# Altium schematic sheet EV_SH.SchDoc
size A4; PageSetup: Record=PageOptions|CenterHorizontal=True|CenterVertical=True|PrintScale=0.97|XCorrection=1.00|YCorrection=1.00|PrintKind=1|BorderSize=5000000|LeftOffset=0|BottomOffset=0|Orientation=2|PaperLength=2970|PaperWidth=2100|Scale=100|PaperSource=4|PrintQuality=600|MediaType=1|DitherType=10|PaperKind=A4|PrintScaleMode=1
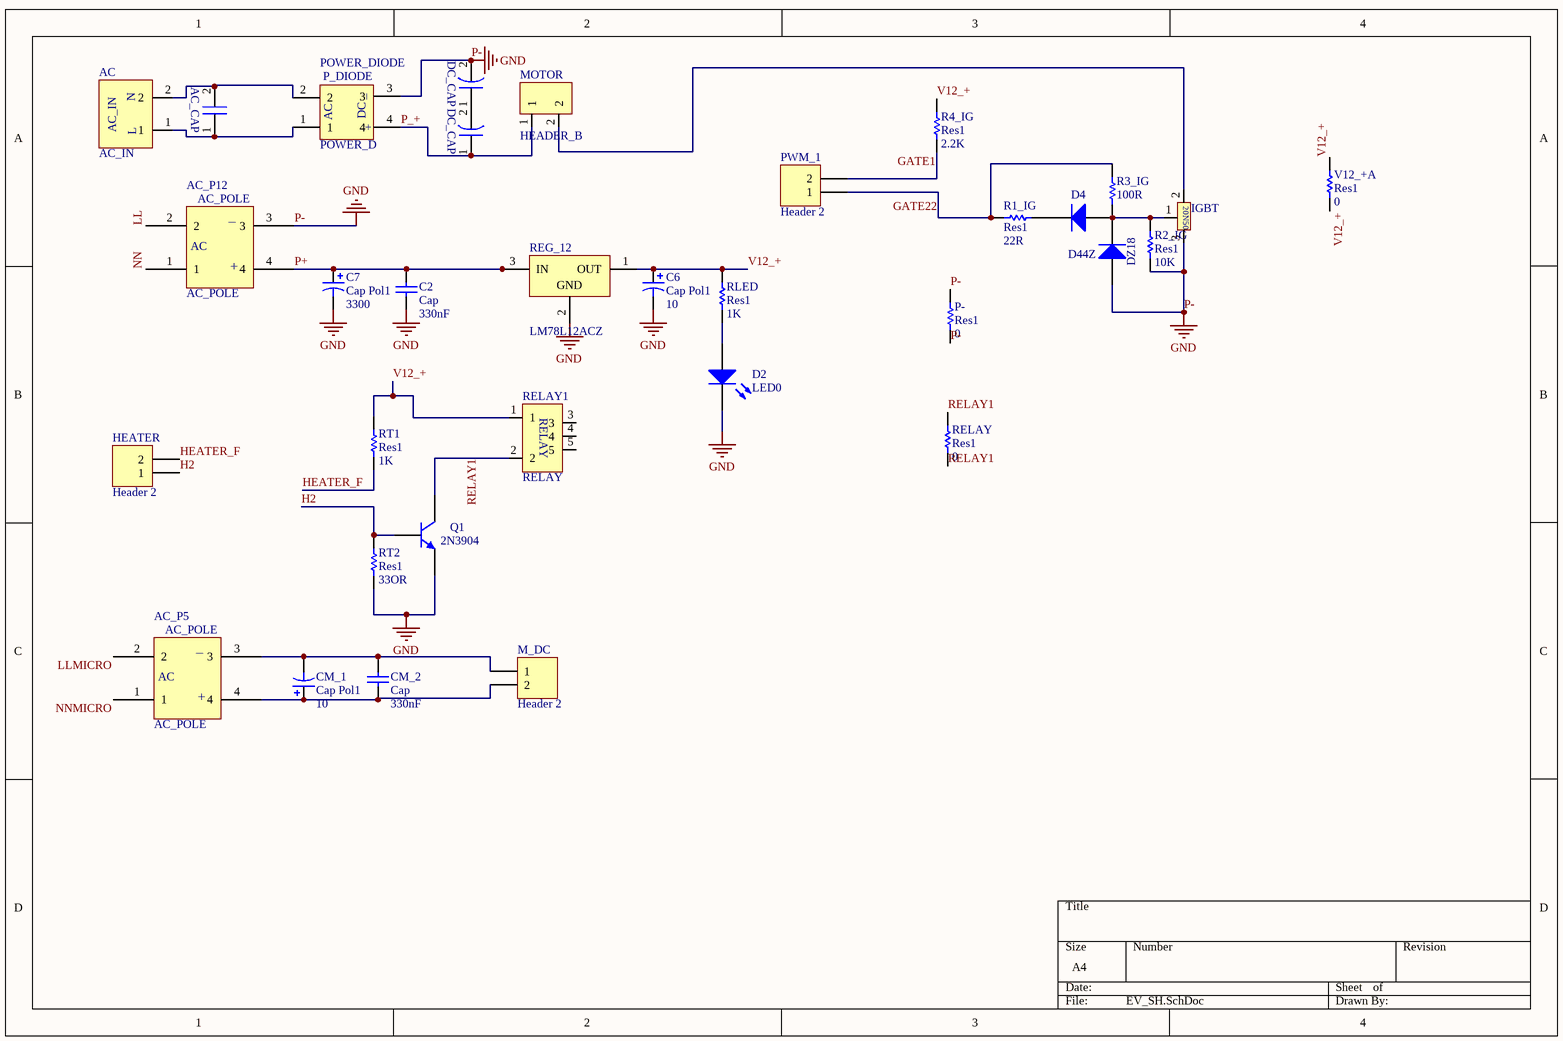
[diagram p0: EV_SH.SchDoc]

## Parts
AC  AC_IN  [AC_IN]
AC_C  AC_CAP  [AC_CAP_P]  (value not drawn)
AC_P5  AC_POLE  [AC_P]
AC_P12  AC_POLE  [AC_P]
C2  Cap  value 330nF  [RAD-0.1]
C6  Cap Pol1  value 10  [C_+]
C7  Cap Pol1  value 3300  [C_+]
CM_1  Cap Pol1  value 10  [C_+]
CM_2  Cap  value 330nF  [RAD-0.1]
D2  LED0  [LED0]
D4  Diode 1N4007  [DIO10.46-5.3x2.8]  (value not drawn)
D44Z  DZ18  [DIO10.46-5.3x2.8]
DC_C  DC_CAP  [DC_CAP_P]  (value not drawn)
DC_C2  DC_CAP  [DC_CAP_P]  (value not drawn)
HEATER  Header 2  [HDR1X2]
IGBT  igbt_20n50  [20N50_S]  (value not drawn)
M_DC  Header 2  [HDR1X2]
MOTOR  HEADER_B  [HEADER_B]
P-  Res1  value 0  [AXIAL-0.3]
POWER_DIODE  POWER_D  [P_DIODE]
PWM_1  Header 2  [HDR1X2]
Q1  2N3904  [BCY-W3/E4]
R1_IG  Res1  value 22R  [AXIAL-0.3]
R2_IG  Res1  value 10K  [AXIAL-0.3]
R3_IG  value 100R  [AXIAL-0.3]  (hidden comment: Res1)
R4_IG  Res1  value 2.2K  [AXIAL-0.3]
REG_12  LM78L12ACZ  [T03B]
RELAY  Res1  value 0  [AXIAL-0.3]
RELAY1  RELAY  [RELAY_OK]
RLED  Res1  value 1K  [AXIAL-0.3]
RT1  Res1  value 1K  [AXIAL-0.3]
RT2  Res1  value 33OR  [AXIAL-0.3]
V12_+A  Res1  value 0  [AXIAL-0.3]

## Nets
P-: AC_P12.3 C2.1 C6.2 C7.2 D2.2(K) D44Z.1(A) DC_C2.2 IGBT.3(E) P-.1 P-.2 POWER_DIODE.3 Q1.1(E) R2_IG.1 REG_12.2(GND) RT2.2  [also labelled GND]
GATE1: PWM_1.2 R4_IG.2
GATE22: PWM_1.1 R1_IG.2 R3_IG.1
H2: HEATER.1 Q1.2(B) RT2.1
HEATER_F: HEATER.2 RT1.2
LL: AC_P12.2
LLMICRO: AC_P5.2
NN: AC_P12.1
NNMICRO: AC_P5.1
P+: AC_P12.4 C2.2 C7.1 REG_12.3(IN)
P_+: DC_C.1 MOTOR.1 POWER_DIODE.4
RELAY1: Q1.3(C) RELAY.1 RELAY.2 RELAY1.2
V12_+: C6.1 R4_IG.1 REG_12.1(OUT) RELAY1.1 RLED.2 RT1.1 V12_+A.1 V12_+A.2
NetAC_1: AC.1 AC_C.1 POWER_DIODE.1
NetAC_2: AC.2 AC_C.2 POWER_DIODE.2
NetAC_P5_3: AC_P5.3 CM_1.2 CM_2.2 M_DC.1
NetAC_P5_4: AC_P5.4 CM_1.1 CM_2.1 M_DC.2
NetD2_1: D2.1(A) RLED.1
NetD4_1: D4.1(A) D44Z.2(K) IGBT.1(G) R2_IG.2 R3_IG.2
NetD4_2: D4.2(K) R1_IG.1
NetDC_C_2: DC_C.2 DC_C2.1
NetIGBT_2: IGBT.2(C) MOTOR.2

Not connected (* = marked no-connect by the designer): RELAY1 3 4 5

## Notes on the sheet
- (in symbol AC_IN) N; L
- (in symbol AC_POLE) _; AC; +
- (in symbol igbt_20n50) 20N50
- (in symbol POWER_D) P_DIODE; _; AC; DC; +

## Library data of the parts
C2 CM_2 = Cap: Capacitor; Published: 8-Jun-2000; LatestRevisionDate: 17-Jul-2002; LatestRevisionNote: Re-released for DXP Platform.; PackageReference: RAD-0.3; Publisher: Altium Limited
C6 C7 CM_1 = Cap Pol1: Polarized Capacitor (Radial); Published: 8-Jun-2000; LatestRevisionDate: 17-Jul-2002; LatestRevisionNote: Re-released for DXP Platform.; PackageReference: RB7.6-15; Publisher: Altium Limited
D2 = LED0: Typical INFRARED GaAs LED; Published: 8-Jun-2000; LatestRevisionDate: 08-Jul-2005; LatestRevisionNote: Mech Layer 1 removed.; PackageReference: LED-0; Publisher: Altium Limited
D4 D44Z = Diode 1N4007: 1 Amp General Purpose Rectifier; Published: 8-Jun-2000; LatestRevisionDate: 17-Jul-2002; LatestRevisionNote: Re-released for DXP Platform.; DatasheetVersion: 1998; PackageVersion: Aug-1999; PackageReference: DO-41; Publisher: Altium Limited; Code_JEDEC: DO-204-AL; ComponentLink1Description: Manufacturer Link; ComponentLink1URL: http://www.fairchildsemi.com/; ComponentLink2Description: Datasheet; ComponentLink2URL: http://www.fairchildsemi.com/ds/1N%2F1N4001.pdf
HEATER M_DC PWM_1 = Header 2: Header, 2-Pin; LatestRevisionDate: 17-Jul-2002; LatestRevisionNote: Re-released for DXP Platform.; Publisher: Altium Limited
P- R1_IG R2_IG R3_IG R4_IG RELAY RLED RT1 RT2 V12_+A = Res1: Resistor; Published: 8-Jun-2000; LatestRevisionDate: 17-Jul-2002; LatestRevisionNote: Re-released for DXP Platform.; PackageReference: AXIAL-0.3; Publisher: Altium Limited
Q1 = 2N3904: NPN General Purpose Amplifier; Published: 8-Jun-2000; LatestRevisionDate: 15-Jan-2003; LatestRevisionNote: PCB Footprint 'BCY-W3/D4.7' replaced; DatasheetVersion: 1997; PackageVersion: Sep-1998; PackageReference: TO-92A; Publisher: Altium Limited; Code_JEDEC: TO-92A; ComponentLink1Description: Manufacturer Link; ComponentLink1URL: http://www.fairchildsemi.com/; ComponentLink2Description: Datasheet; ComponentLink2URL: http://www.fairchildsemi.com/ds/2N%2F2N3904.pdf
REG_12 = LM78L12ACZ: 3-Terminal Positive Regulators; Manufacturer: National Semiconductor; CompType: LDO IC; PackageTopMarking: NSXYTT*LM78L*12ACZ; PowerWise: N; Published: 4-Dec-2008; DatasheetVersion: Apr-2006; PackageVersion: revG, Sep-2000; PackageReference: Z03A; Publisher: Altium Limited; PackageDescription: TO-92, Molded, 3 Lead; PartNumber: LM78L12ACZ; RoHS: O; PinCount: 3; DigiKeyPartNumber: LM78L12ACZ-ND; Code_JEDEC: TO-226-AA; ComponentLink1Description: LM78L12 Datasheet; ComponentLink1URL: http://www.national.com/ds/LM/LM78L12.pdf; ComponentLink2Description: LM78L12 Web Page; ComponentLink2URL: http://www.national.com/pf/LM/LM78L12.html; ComponentLink3Description: Z03A Package Page; ComponentLink3URL: http://www.national.com/packaging/folders/z03a.html